# EAGLE design board-Type-C-31-M-12 (EAGLE 9.6.0)
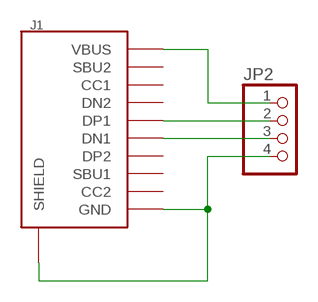
[diagram p0: schematic, sheet 1]

## Parts
J1  USB-TYPE-C-31-M-12  [USB-TYPE-C-31-M-12]
JP2  PINHD-1X4/OCT  [1X04/OCT]

## Nets
N$1 [power]: J1.VBUS1(VBUS) J1.VBUS2(VBUS) JP2.1
N$2: J1.A6(DP1) JP2.2
N$3: J1.A7(DN1) JP2.3
N$4 [power]: J1.GND1(GND) J1.GND2(GND) J1.SHLD-B1(SHIELD) J1.SHLD-B2(SHIELD) J1.SHLD-B3(SHIELD) J1.SHLD-B4(SHIELD) J1.SHLD-T1(SHIELD) J1.SHLD-T2(SHIELD) J1.SHLD-T3(SHIELD) J1.SHLD-T4(SHIELD) JP2.4
Unconnected: J1.A5(CC1) J1.A8(SBU1) J1.B5(CC2) J1.B6(DP2) J1.B7(DN2) J1.B8(SBU2)

## Library data of the parts
J1 = angrypig7-Connectors:USB-TYPE-C-31-M-12: Type-C-31-M12 By Korean Hroparts Elec link <https://lcsc.com/product-detail/USB-Type-C_Korean-Hroparts-Elec-TYPE-C-31-M-12_C165948.html>
JP2 = pinhead_v2:PINHD-1X4: PIN HEADER

## Net classes
0 default: width 0.254 mm
1 power: width 0.457 mm

## Board
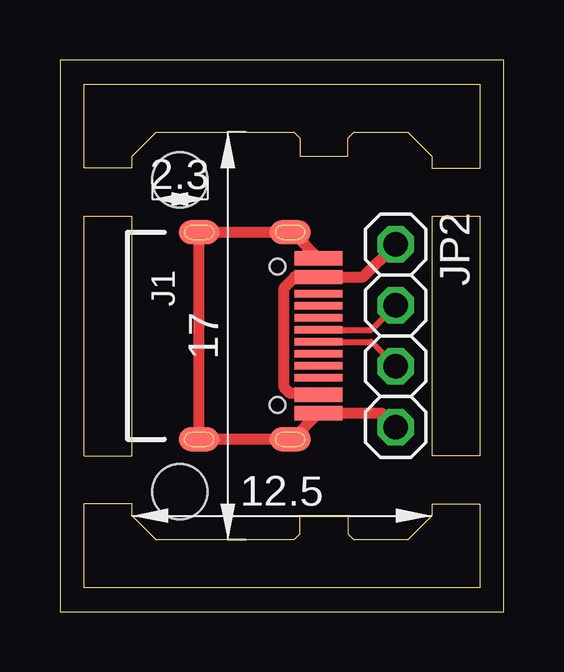
[diagram p1: board, top side]
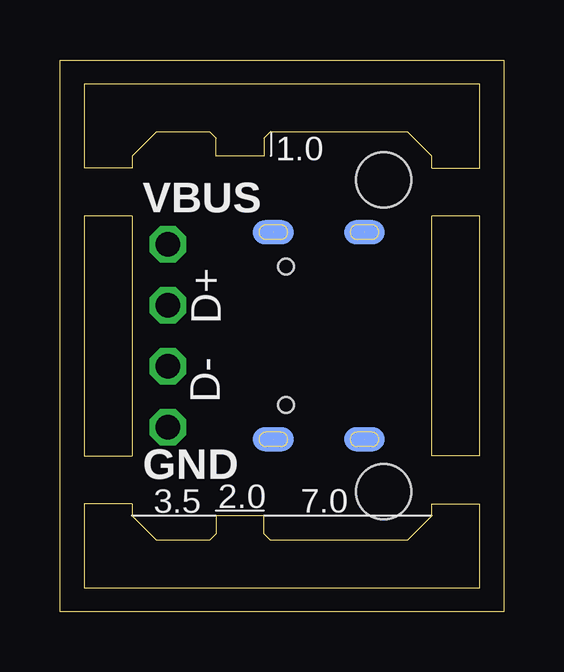
[diagram p2: board, bottom side, seen from below]

Size 18.5 x 23 mm. Coordinates in mm from the lower left corner, seen from the top.
Outline: 3,4 3,4.5 1,4.5 1,1 17.5,1 17.5,4.5 15.5,4.5 15.5,4 14.5,3 12.25,3 12,3.25 12,4 10,4 10,3.25 9.75,3 4,3 3,4
Outline: 3,6.5 3,16.5 1,16.5 1,6.5 3,6.5
Outline: 3,18.5 3,19 4,20 9.75,20 10,19.75 10,19 12,19 12,19.75 12.25,20 14.5,20 15.5,19 15.5,18.5 17.5,18.5 17.5,22 1,22 1,18.5 3,18.5
Outline: 15.5,16.5 15.5,6.5 17.5,6.5 17.5,16.5 15.5,16.5
Outline: 0,0 18.5,0 18.5,23 0,23 0,0
Copper layers (1*16): Top 0.035mm / dielectric 1.5mm / Bottom 0.035mm
Design rules "default *": minimum track width 6mil, minimum drill 0.35mm, track to track 6mil, track to pad 6mil, pad to pad 6mil, via to via 6mil, smd to smd 6mil, copper to edge 4mil, drill to drill 6mil, minimum pad ring 10mil, minimum via ring 8mil, stop-mask expansion 4mil, vias tented up to drill 0mil, thermal gap 10mil
Holes 2.3 mm at 5,18 5,5

### Footprints (pad centres in the part's own frame; a part is rotated, then mirrored left to right if it is on the bottom)
USB-TYPE-C-31-M-12 = smd 0.3 x 2: A5 -1.25,1.19; A6 -0.25,1.19; A7 0.25,1.19; A8 1.25,1.19; B5 1.75,1.19; B6 0.75,1.19; B7 -0.75,1.19; B8 -1.75,1.19 | smd 0.6 x 2: GND1 -3.225,1.19; GND2 3.225,1.19; VBUS1 -2.45,1.19; VBUS2 2.45,1.19 | smd 1 x 1.7 bottom: SHLD-B1 -4.32,0; SHLD-B2 4.32,0; SHLD-B3 -4.32,-3.8; SHLD-B4 4.32,-3.8 | smd 1 x 1.7: SHLD-T1 -4.32,0; SHLD-T2 4.32,0; SHLD-T3 -4.32,-3.8; SHLD-T4 4.32,-3.8 | hole 0.65: -2.89,-0.53; 2.89,-0.53
1X04/OCT = drill 1.016 octagon: 1 -3.81,0; 2 -1.27,0; 3 1.27,0; 4 3.81,0

### Placement (x,y rotation side)
J1  9.6,11.5 270 top
JP2  14,11.5 270 top

### Tracks (layer width: path | path; a pad name or v marks a point on that pad's centre or on a via)
N$1
  Top 0.457: J1.VBUS2 10.74,9.1 9.6,9.1 9.35,9.35 9.35,13.5 9.8,13.95 J1.VBUS1 12.64,13.95 JP2.1
N$2
  Top 0.254: J1.A6 12.98,11.75 JP2.2
N$3
  Top 0.254: J1.A7 12.98,11.25 JP2.3
N$4  (4 unrouted)
  Top 0.457: J1.GND1 9.7,15.82 J1.SHLD-B1 J1.SHLD-B3 J1.SHLD-B4 J1.SHLD-T2 9.7,7.18 J1.GND2 13.41,8.28 JP2.4

### Text on the board
bPlace: 1.0 | VBUS | D+ | D- | GND | 7.0 | 2.0 | 3.5